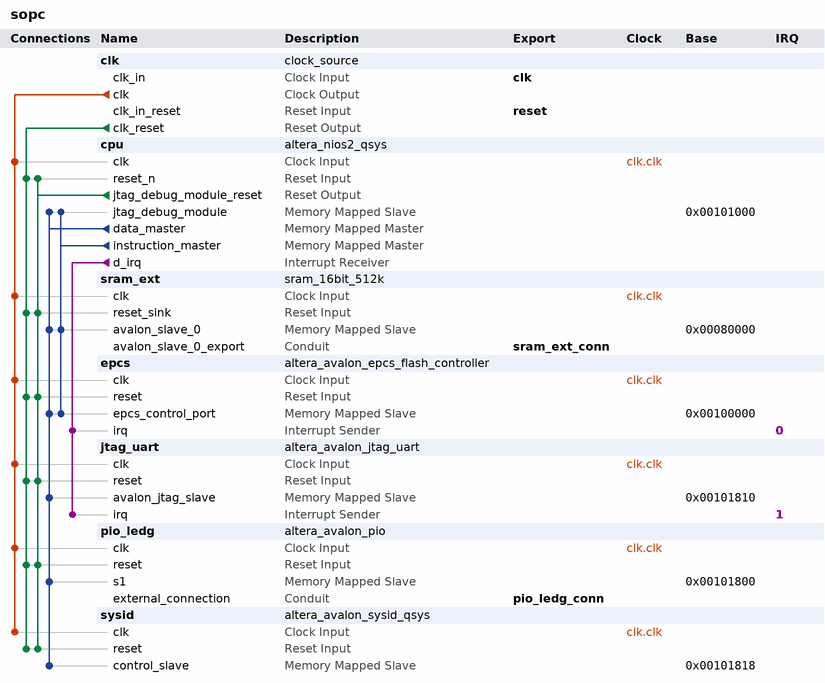
[diagram p0: system contents]
# Platform Designer (Qsys) system sopc, Cyclone II EP2C35F672C6
# Parameters at their usual value, and those the tool derives, are not listed.
package require -exact qsys 13.0
create_system sopc
set_project_property DEVICE_FAMILY {Cyclone II}
set_project_property DEVICE EP2C35F672C6

add_instance clk clock_source 13.0
set_instance_parameter_value clk clockFrequency 50000000

add_instance cpu altera_nios2_qsys 13.0
set_instance_parameter_value cpu resetSlave epcs.epcs_control_port
set_instance_parameter_value cpu mmu_TLBMissExcSlave None
set_instance_parameter_value cpu exceptionSlave sram_ext.avalon_slave_0
set_instance_parameter_value cpu breakSlave cpu.jtag_debug_module
set_instance_parameter_value cpu impl Tiny
set_instance_parameter_value cpu icache_size 4096

add_instance sram_ext sram_16bit_512k 1.0.3

add_instance epcs altera_avalon_epcs_flash_controller 13.0.1.99.2
set_instance_parameter_value epcs autoSelectASMIAtom false
set_instance_parameter_value epcs useASMIAtom true

add_instance jtag_uart altera_avalon_jtag_uart 13.0.1.99.2
set_instance_parameter_value jtag_uart simInteractiveOptions NO_INTERACTIVE_WINDOWS

add_instance pio_ledg altera_avalon_pio 13.0.1.99.2
set_instance_parameter_value pio_ledg direction Output
set_instance_parameter_value pio_ledg width 8

add_instance sysid altera_avalon_sysid_qsys 13.0
set_instance_parameter_value sysid id 11141120

# connections
add_connection clk.clk cpu.clk clock
add_connection clk.clk epcs.clk clock
add_connection clk.clk jtag_uart.clk clock
add_connection clk.clk pio_ledg.clk clock
add_connection clk.clk sram_ext.clk clock
add_connection clk.clk sysid.clk clock
add_connection clk.clk_reset cpu.reset_n reset
add_connection clk.clk_reset epcs.reset reset
add_connection clk.clk_reset jtag_uart.reset reset
add_connection clk.clk_reset pio_ledg.reset reset
add_connection clk.clk_reset sram_ext.reset_sink reset
add_connection clk.clk_reset sysid.reset reset
add_connection cpu.jtag_debug_module_reset cpu.reset_n reset
add_connection cpu.jtag_debug_module_reset epcs.reset reset
add_connection cpu.jtag_debug_module_reset jtag_uart.reset reset
add_connection cpu.jtag_debug_module_reset pio_ledg.reset reset
add_connection cpu.jtag_debug_module_reset sram_ext.reset_sink reset
add_connection cpu.jtag_debug_module_reset sysid.reset reset
add_connection cpu.data_master cpu.jtag_debug_module avalon
set_connection_parameter_value cpu.data_master/cpu.jtag_debug_module baseAddress 0x00101000
add_connection cpu.data_master epcs.epcs_control_port avalon
set_connection_parameter_value cpu.data_master/epcs.epcs_control_port baseAddress 0x00100000
add_connection cpu.data_master jtag_uart.avalon_jtag_slave avalon
set_connection_parameter_value cpu.data_master/jtag_uart.avalon_jtag_slave baseAddress 0x00101810
add_connection cpu.data_master pio_ledg.s1 avalon
set_connection_parameter_value cpu.data_master/pio_ledg.s1 baseAddress 0x00101800
add_connection cpu.data_master sram_ext.avalon_slave_0 avalon
set_connection_parameter_value cpu.data_master/sram_ext.avalon_slave_0 baseAddress 0x00080000
add_connection cpu.data_master sysid.control_slave avalon
set_connection_parameter_value cpu.data_master/sysid.control_slave baseAddress 0x00101818
add_connection cpu.instruction_master cpu.jtag_debug_module avalon
set_connection_parameter_value cpu.instruction_master/cpu.jtag_debug_module baseAddress 0x00101000
add_connection cpu.instruction_master epcs.epcs_control_port avalon
set_connection_parameter_value cpu.instruction_master/epcs.epcs_control_port baseAddress 0x00100000
add_connection cpu.instruction_master sram_ext.avalon_slave_0 avalon
set_connection_parameter_value cpu.instruction_master/sram_ext.avalon_slave_0 baseAddress 0x00080000
add_connection cpu.d_irq epcs.irq interrupt
set_connection_parameter_value cpu.d_irq/epcs.irq irqNumber 0
add_connection cpu.d_irq jtag_uart.irq interrupt
set_connection_parameter_value cpu.d_irq/jtag_uart.irq irqNumber 1

# exported interfaces
add_interface clk clock sink
set_interface_property clk EXPORT_OF clk.clk_in
add_interface reset reset sink
set_interface_property reset EXPORT_OF clk.clk_in_reset
add_interface pio_ledg_conn conduit end
set_interface_property pio_ledg_conn EXPORT_OF pio_ledg.external_connection
add_interface sram_ext_conn conduit end
set_interface_property sram_ext_conn EXPORT_OF sram_ext.avalon_slave_0_export

set_interconnect_requirement {$system} qsys_mm.clockCrossingAdapter HANDSHAKE
set_interconnect_requirement {$system} qsys_mm.maxAdditionalLatency 1

save_system sopc.qsys
